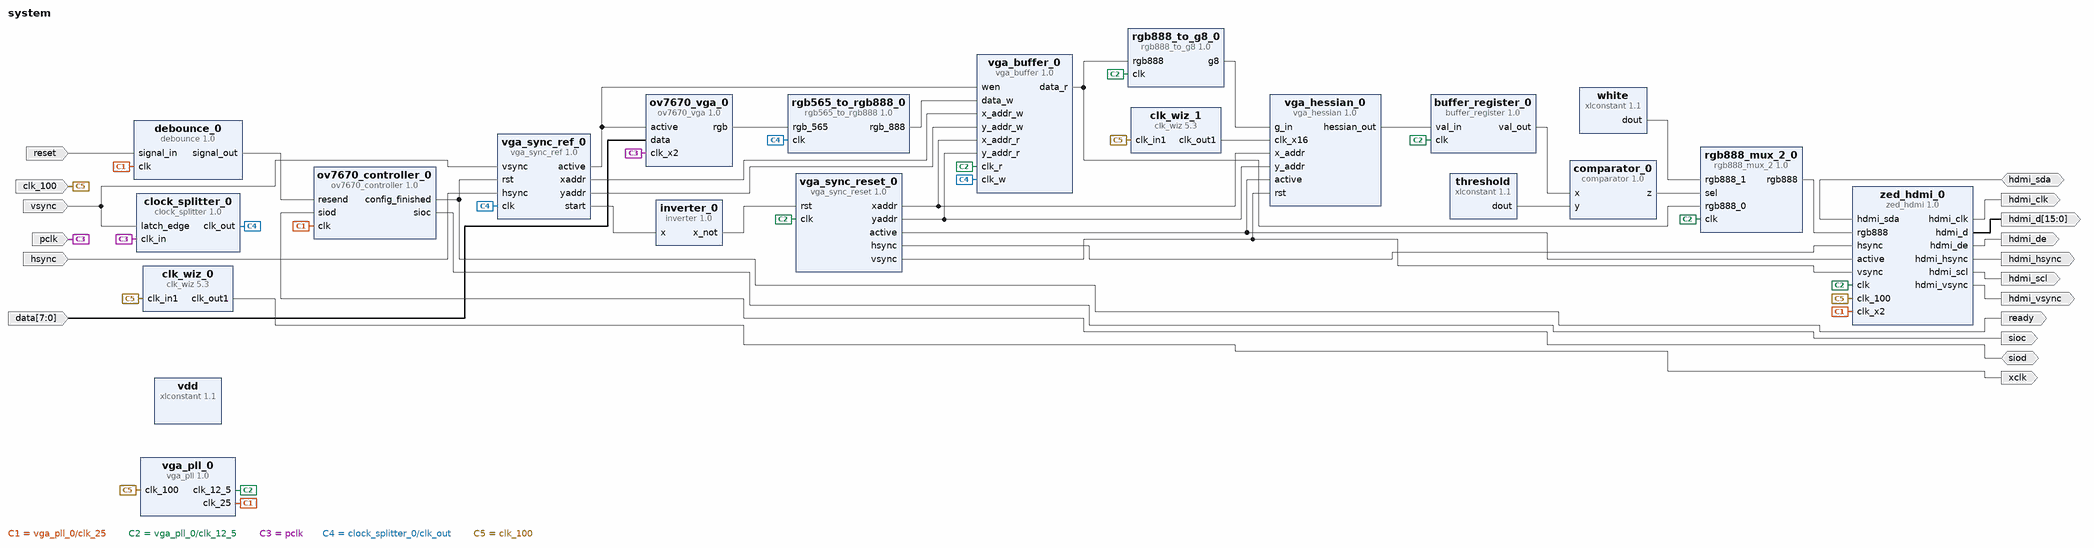
[diagram p0: block diagram of the top level]
# Vivado block design system, xc7z020clg484-1, Vivado 2016.4
create_bd_design system

create_bd_port -dir O -type clk hdmi_clk
create_bd_port -dir O hdmi_hsync
create_bd_port -dir O hdmi_vsync
create_bd_port -dir O -from 15 -to 0 hdmi_d
create_bd_port -dir O hdmi_de
create_bd_port -dir O hdmi_scl
create_bd_port -dir IO hdmi_sda
create_bd_port -dir O ready
create_bd_port -dir O sioc
create_bd_port -dir IO siod
create_bd_port -dir I -from 7 -to 0 data
create_bd_port -dir I hsync
create_bd_port -dir I vsync
create_bd_port -dir O xclk
create_bd_port -dir I reset
create_bd_port -dir I pclk
create_bd_port -dir I clk_100

create_bd_cell -type ip -vlnv xilinx.com:user:ov7670_controller:1.0 ov7670_controller_0
create_bd_cell -type ip -vlnv xilinx.com:user:zed_hdmi:1.0 zed_hdmi_0
create_bd_cell -type ip -vlnv xilinx.com:user:rgb565_to_rgb888:1.0 rgb565_to_rgb888_0
create_bd_cell -type ip -vlnv xilinx.com:user:vga_buffer:1.0 vga_buffer_0
set_property -dict {CONFIG.SIZE_POW2 10} [get_bd_cells vga_buffer_0]
create_bd_cell -type ip -vlnv xilinx.com:user:vga_sync_reset:1.0 vga_sync_reset_0
create_bd_cell -type ip -vlnv xilinx.com:user:vga_sync_ref:1.0 vga_sync_ref_0
create_bd_cell -type ip -vlnv xilinx.com:user:debounce:1.0 debounce_0
create_bd_cell -type ip -vlnv xilinx.com:user:ov7670_vga:1.0 ov7670_vga_0
create_bd_cell -type ip -vlnv xilinx.com:user:clock_splitter:1.0 clock_splitter_0
create_bd_cell -type ip -vlnv xilinx.com:user:rgb888_to_g8:1.0 rgb888_to_g8_0
create_bd_cell -type ip -vlnv xilinx.com:user:rgb888_mux_2:1.0 rgb888_mux_2_0
create_bd_cell -type ip -vlnv xilinx.com:ip:xlconstant:1.1 white
set_property -dict {CONFIG.CONST_WIDTH 24 CONFIG.CONST_VAL 16777215} [get_bd_cells white]
create_bd_cell -type ip -vlnv xilinx.com:user:comparator:1.0 comparator_0
create_bd_cell -type ip -vlnv xilinx.com:ip:xlconstant:1.1 threshold
set_property -dict {CONFIG.CONST_WIDTH 32 CONFIG.CONST_VAL 10000} [get_bd_cells threshold]
create_bd_cell -type ip -vlnv xilinx.com:ip:clk_wiz:5.3 clk_wiz_0
set_property -dict [list \
  CONFIG.PRIMITIVE MMCM \
  CONFIG.USE_PHASE_ALIGNMENT true \
  CONFIG.SECONDARY_SOURCE Single_ended_clock_capable_pin \
  CONFIG.CLKOUT2_USED false \
  CONFIG.NUM_OUT_CLKS 1 \
  CONFIG.CLKOUT1_REQUESTED_OUT_FREQ 11.9 \
  CONFIG.CLKOUT2_REQUESTED_OUT_FREQ 200.000 \
  CONFIG.PRIM_SOURCE Single_ended_clock_capable_pin \
  CONFIG.CLKOUT1_DRIVES BUFG \
  CONFIG.CLKOUT2_DRIVES BUFG \
  CONFIG.CLKOUT3_DRIVES BUFG \
  CONFIG.CLKOUT4_DRIVES BUFG \
  CONFIG.CLKOUT5_DRIVES BUFG \
  CONFIG.CLKOUT6_DRIVES BUFG \
  CONFIG.CLKOUT7_DRIVES BUFG \
  CONFIG.FEEDBACK_SOURCE FDBK_AUTO \
  CONFIG.USE_RESET false \
  CONFIG.MMCM_DIVCLK_DIVIDE 5 \
  CONFIG.MMCM_CLKFBOUT_MULT_F 44.625 \
  CONFIG.MMCM_COMPENSATION ZHOLD \
  CONFIG.MMCM_CLKOUT0_DIVIDE_F 75.000 \
  CONFIG.MMCM_CLKOUT1_DIVIDE 1 \
  CONFIG.CLKOUT1_JITTER 394.277 \
  CONFIG.CLKOUT1_PHASE_ERROR 301.475 \
  CONFIG.CLKOUT2_JITTER 126.455 \
  CONFIG.CLKOUT2_PHASE_ERROR 114.212 \
] [get_bd_cells clk_wiz_0]
create_bd_cell -type ip -vlnv xilinx.com:user:vga_pll:1.0 vga_pll_0
create_bd_cell -type ip -vlnv xilinx.com:ip:clk_wiz:5.3 clk_wiz_1
set_property -dict [list \
  CONFIG.PRIMITIVE PLL \
  CONFIG.CLKOUT1_REQUESTED_OUT_FREQ 200.000 \
  CONFIG.CLKOUT1_DRIVES BUFG \
  CONFIG.CLKOUT2_DRIVES BUFG \
  CONFIG.CLKOUT3_DRIVES BUFG \
  CONFIG.CLKOUT4_DRIVES BUFG \
  CONFIG.CLKOUT5_DRIVES BUFG \
  CONFIG.CLKOUT6_DRIVES BUFG \
  CONFIG.CLKOUT7_DRIVES BUFG \
  CONFIG.USE_RESET false \
  CONFIG.RESET_PORT resetn \
  CONFIG.MMCM_DIVCLK_DIVIDE 1 \
  CONFIG.MMCM_CLKFBOUT_MULT_F 10 \
  CONFIG.MMCM_COMPENSATION ZHOLD \
  CONFIG.MMCM_CLKOUT0_DIVIDE_F 5 \
  CONFIG.RESET_TYPE ACTIVE_LOW \
  CONFIG.CLKOUT1_JITTER 114.829 \
] [get_bd_cells clk_wiz_1]
create_bd_cell -type ip -vlnv xilinx.com:ip:xlconstant:1.1 vdd
create_bd_cell -type ip -vlnv xilinx.com:user:buffer_register:1.0 buffer_register_0
create_bd_cell -type ip -vlnv user.org:user:inverter:1.0 inverter_0
create_bd_cell -type ip -vlnv xilinx.com:user:vga_hessian:1.0 vga_hessian_0

# ---- connections ----

connect_bd_net [get_bd_pins zed_hdmi_0/hdmi_clk] [get_bd_ports hdmi_clk]
connect_bd_net [get_bd_pins zed_hdmi_0/hdmi_hsync] [get_bd_ports hdmi_hsync]
connect_bd_net [get_bd_pins zed_hdmi_0/hdmi_vsync] [get_bd_ports hdmi_vsync]
connect_bd_net [get_bd_pins zed_hdmi_0/hdmi_d] [get_bd_ports hdmi_d]
connect_bd_net [get_bd_pins zed_hdmi_0/hdmi_de] [get_bd_ports hdmi_de]
connect_bd_net [get_bd_pins zed_hdmi_0/hdmi_scl] [get_bd_ports hdmi_scl]
connect_bd_net [get_bd_ports hdmi_sda] [get_bd_pins zed_hdmi_0/hdmi_sda]
connect_bd_net [get_bd_pins ov7670_controller_0/config_finished] [get_bd_ports ready] [get_bd_pins vga_sync_ref_0/rst]
connect_bd_net [get_bd_pins ov7670_controller_0/sioc] [get_bd_ports sioc]
connect_bd_net [get_bd_ports siod] [get_bd_pins ov7670_controller_0/siod]
connect_bd_net [get_bd_ports data] [get_bd_pins ov7670_vga_0/data]
connect_bd_net [get_bd_pins ov7670_vga_0/rgb] [get_bd_pins rgb565_to_rgb888_0/rgb_565]
connect_bd_net [get_bd_ports hsync] [get_bd_pins vga_sync_ref_0/hsync]
connect_bd_net [get_bd_ports vsync] [get_bd_pins vga_sync_ref_0/vsync] [get_bd_pins clock_splitter_0/latch_edge]
connect_bd_net [get_bd_pins vga_sync_ref_0/active] [get_bd_pins vga_buffer_0/wen] [get_bd_pins ov7670_vga_0/active]
connect_bd_net [get_bd_pins vga_sync_reset_0/xaddr] [get_bd_pins vga_buffer_0/x_addr_r] [get_bd_pins vga_hessian_0/x_addr]
connect_bd_net [get_bd_pins vga_sync_reset_0/yaddr] [get_bd_pins vga_buffer_0/y_addr_r] [get_bd_pins vga_hessian_0/y_addr]
connect_bd_net [get_bd_pins vga_pll_0/clk_25] [get_bd_pins zed_hdmi_0/clk_x2] [get_bd_pins ov7670_controller_0/clk] [get_bd_pins debounce_0/clk]
connect_bd_net [get_bd_pins vga_pll_0/clk_12_5] \
  [get_bd_pins zed_hdmi_0/clk] [get_bd_pins vga_buffer_0/clk_r] [get_bd_pins vga_sync_reset_0/clk] \
  [get_bd_pins rgb888_to_g8_0/clk] [get_bd_pins rgb888_mux_2_0/clk] [get_bd_pins buffer_register_0/clk]
connect_bd_net [get_bd_pins vga_sync_reset_0/hsync] [get_bd_pins zed_hdmi_0/hsync]
connect_bd_net [get_bd_pins vga_sync_reset_0/active] [get_bd_pins zed_hdmi_0/active] [get_bd_pins vga_hessian_0/active]
connect_bd_net [get_bd_pins vga_sync_reset_0/vsync] [get_bd_pins zed_hdmi_0/vsync] [get_bd_pins vga_hessian_0/rst]
connect_bd_net [get_bd_pins clk_wiz_0/clk_out1] [get_bd_ports xclk]
connect_bd_net [get_bd_pins vga_sync_ref_0/xaddr] [get_bd_pins vga_buffer_0/x_addr_w]
connect_bd_net [get_bd_pins vga_sync_ref_0/yaddr] [get_bd_pins vga_buffer_0/y_addr_w]
connect_bd_net -net debounce_0_o [get_bd_pins debounce_0/signal_out] [get_bd_pins ov7670_controller_0/resend]
connect_bd_net [get_bd_ports reset] [get_bd_pins debounce_0/signal_in]
connect_bd_net [get_bd_ports pclk] [get_bd_pins ov7670_vga_0/clk_x2] [get_bd_pins clock_splitter_0/clk_in]
connect_bd_net [get_bd_pins clock_splitter_0/clk_out] \
  [get_bd_pins rgb565_to_rgb888_0/clk] [get_bd_pins vga_buffer_0/clk_w] [get_bd_pins vga_sync_ref_0/clk]
connect_bd_net [get_bd_pins rgb565_to_rgb888_0/rgb_888] [get_bd_pins vga_buffer_0/data_w]
connect_bd_net [get_bd_pins rgb888_to_g8_0/g8] [get_bd_pins vga_hessian_0/g_in]
connect_bd_net -net xlconstant_0_dout [get_bd_pins white/dout] [get_bd_pins rgb888_mux_2_0/rgb888_1]
connect_bd_net -net clk_100_1 [get_bd_ports clk_100] \
  [get_bd_pins vga_pll_0/clk_100] [get_bd_pins clk_wiz_0/clk_in1] [get_bd_pins zed_hdmi_0/clk_100] \
  [get_bd_pins clk_wiz_1/clk_in1]
connect_bd_net [get_bd_pins clk_wiz_1/clk_out1] [get_bd_pins vga_hessian_0/clk_x16]
connect_bd_net [get_bd_pins vga_hessian_0/hessian_out] [get_bd_pins buffer_register_0/val_in]
connect_bd_net [get_bd_pins vga_buffer_0/data_r] [get_bd_pins rgb888_to_g8_0/rgb888] [get_bd_pins rgb888_mux_2_0/rgb888_0]
connect_bd_net [get_bd_pins rgb888_mux_2_0/rgb888] [get_bd_pins zed_hdmi_0/rgb888]
connect_bd_net [get_bd_pins comparator_0/z] [get_bd_pins rgb888_mux_2_0/sel]
connect_bd_net [get_bd_pins vga_sync_ref_0/start] [get_bd_pins inverter_0/x]
connect_bd_net [get_bd_pins inverter_0/x_not] [get_bd_pins vga_sync_reset_0/rst]
connect_bd_net [get_bd_pins threshold/dout] [get_bd_pins comparator_0/y]
connect_bd_net [get_bd_pins buffer_register_0/val_out] [get_bd_pins comparator_0/x]

validate_bd_design
save_bd_design
